# EAGLE design Light Cube (EAGLE 6.4)
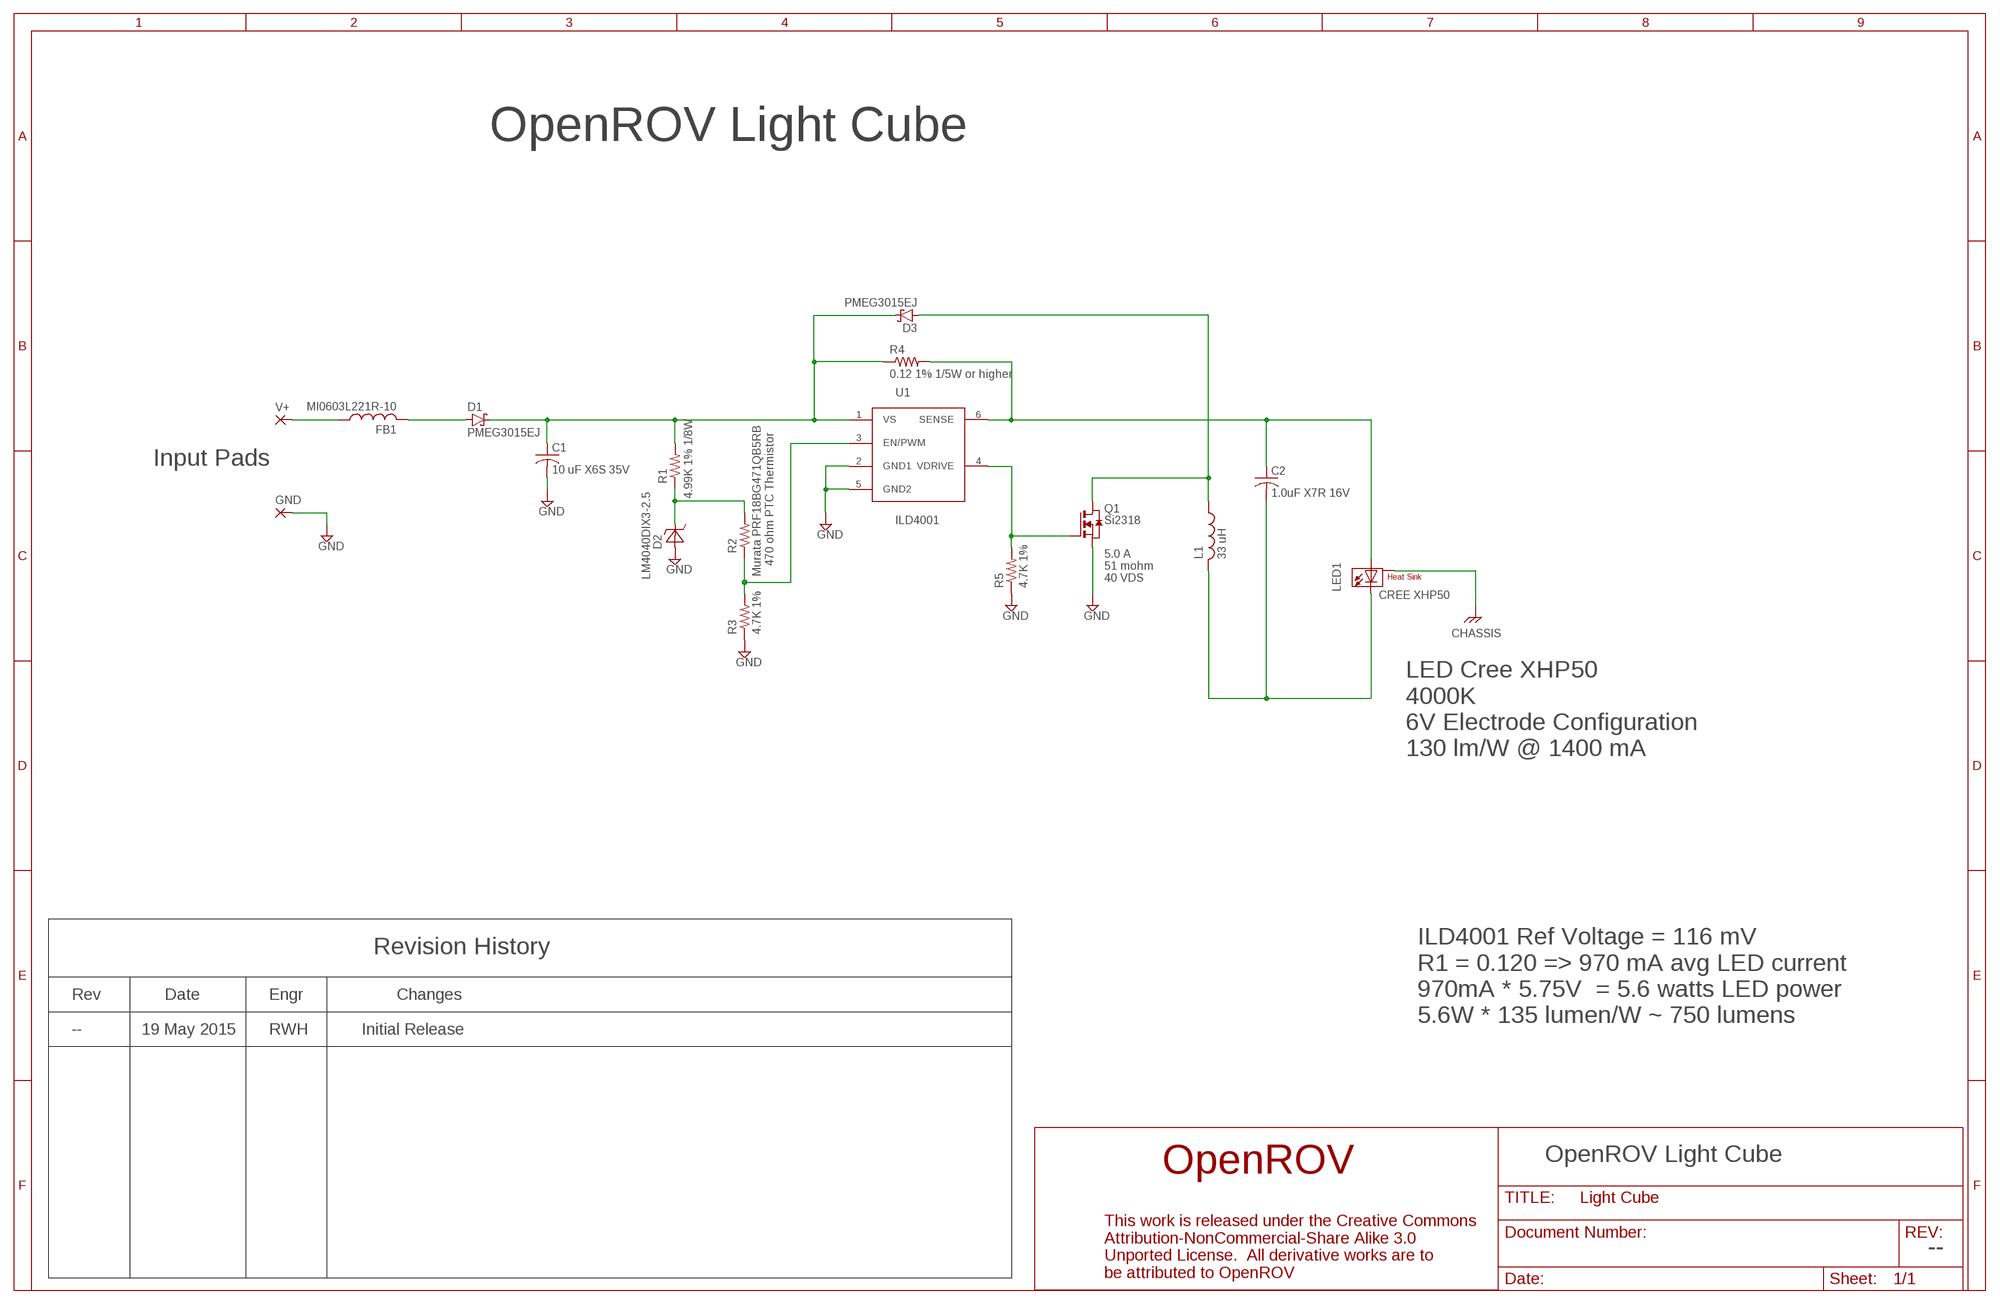
[diagram p0: schematic, sheet 1]

## Parts
C1  10 uF X6S 35V  CAP0805  [R0805]
C2  1.0uF X7R 16V  CAP0603  [R0603]
D1  PMEG3015EJ  SCHOTTKYSOD323  [SOD323]
D2  LM4040DIX3-2.5  ZENER-TVS-SC70-3  [SC70-3]
D3  PMEG3015EJ  SCHOTTKYSOD323  [SOD323]
FB1  MI0603L221R-10  FERRITESIZE_0603  [R0603]
GND  SMD_PAD3/3  [SMD_3_3]
L1  33 uH  INDUCTOR-LAIRD_TYS6045  [INDUCTOR_LAIRD_TYS6045]
LED1  CREE XHP50  LED_WITH_HEATSINK-CREE_XHP50_6V  [CREE_XHP50_6V]
Q1  Si2318  NMOS-FETSOT23  [SOT23]
R1  4.99K 1% 1/8W  RESISTOR-0402  [R0402]
R2  Murata PRF18BG471QB5RB  RESISTOR-0603  [R0603]
R3  4.7K 1%  RESISTOR-0402  [R0402]
R4  0.12 1% 1/5W or higher  RESISTOR-0603  [R0603]
R5  4.7K 1%  RESISTOR-0402  [R0402]
U1  ILD4001  [SC74_INFINEON]
V+  SMD_PAD-2/2  [SMD_2_2]

## Nets
CHASSIS: LED1.SINK(HEATSINK)
GND: C1.2 D2.2(A) GND.1(P) Q1.2(S) R3.1 R5.1 U1.2(GND1) U1.5(GND2)
N$1: D2.1(C) R1.1 R2.2
N$2: FB1.1 V+.1(P)
N$3: D1.A FB1.2
N$5: C1.1 D1.C D3.C R1.2 R4.1 U1.1(VS)
N$6: R2.1 R3.2 U1.3(EN/PWM)
N$7: C2.1 LED1.A R4.2 U1.6(SENSE)
N$8: D3.A L1.P$1 Q1.3(D)
N$9: C2.2 L1.P$2 LED1.C
N$11: Q1.1(G) R5.2 U1.4(VDRIVE)

## Notes on the sheet
- OpenROV Light Cube
- Input Pads
- 470 ohm PTC Thermistor
- 5.0 A
  51 mohm
  40 VDS
- LED Cree XHP50
  4000K
  6V Electrode Configuration
  130 lm/W @ 1400 mA
- Revision History
- Rev | Date | Engr | Changes
- ILD4001 Ref Voltage = 116 mV
  R1 = 0.120 => 970 mA avg LED current
  970mA * 5.75V  = 5.6 watts LED power
  5.6W * 135 lumen/W ~ 750 lumens
- -- | 19 May 2015 | RWH | Initial Release
- OpenROV Light Cube
- --

## Library data of the parts
C1 C2 = Walts_Generic_Parts:CAP: Generic Non-Polarized Capacitor
D1 D3 = Walts_Generic_Parts:SCHOTTKY: Silicon Schottky Diodes
D2 = Walts_Generic_Parts:ZENER-TVS: Generic Zener Diode, TVS, or Reference Diode
FB1 = Walts_Generic_Parts:FERRITE: Generic Surface Mount Ferrite Chip
GND V+ = Walts Test Points and Pads:SMD_PAD: SMD PAD
L1 = Walts_Generic_Parts:INDUCTOR: Generic Inductor Footprint
LED1 = OpenROV LED Library:LED_WITH_HEATSINK: Power LED packages with a heatsink pad
Q1 = Walts_Generic_Parts:NMOS-FET: Generic NMOS FET
R1-R5 = Walts_Generic_Parts:RESISTOR: Generic Resistor
U1 = OpenROV LED Library:ILD4001: Infineon ILD4001 Buck LED Controller

## Board
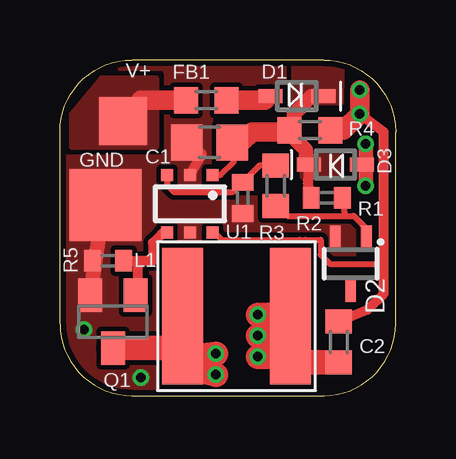
[diagram p1: board, top side]
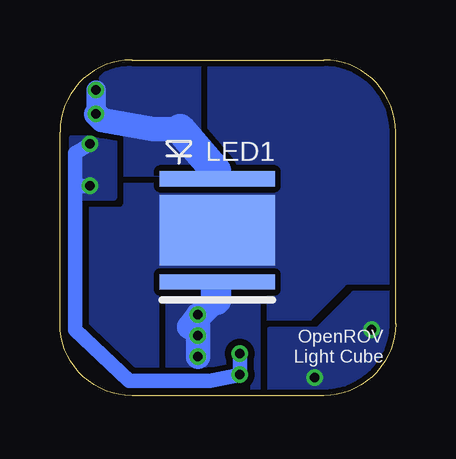
[diagram p2: board, bottom side, seen from below]

Size 14 x 14 mm. Coordinates in mm from the lower left corner, seen from the top.
Outline: 3,0 11,0 arc90 14,3 14,11 arc90 11,14 3,14 arc90 0,11 0,3 arc90 3,0
Copper layers (1*2*15*16): Top 0.035mm / dielectric 0.2mm / Route2 0.0175mm / dielectric 1.1mm / Route15 0.0175mm / dielectric 0.2mm / Bottom 0.035mm
Design rules "SeeedStudio_DRU_no_angle_20130527": minimum track width 6mil, minimum drill 12mil, track to track 6mil, track to pad 6mil, pad to pad 6mil, via to via 6mil, smd to smd 0mil, copper to edge 10mil, drill to drill 10mil, minimum pad ring 6mil, minimum via ring 6mil, stop-mask expansion 2mil, vias tented up to drill 25mil, thermal gap 10mil

### Footprints (pad centres in the part's own frame; a part is rotated, then mirrored left to right if it is on the bottom)
R0805 = smd 1.3 x 1.5: 1 -0.95,0; 2 0.95,0
R0603 = smd 1 x 1.1: 1 -0.85,0; 2 0.85,0
SOD323 = smd 1 x 0.6: A 1.1,0; C -1.1,0
SC70-3 = smd 0.45 x 1.1: 1 -0.65,-1.05; 2 0.65,-1.05; 3 0,1.05
SMD_3_3 = smd 3 x 3: 1 0,0
INDUCTOR_LAIRD_TYS6045 = smd 1.7 x 5.7: P$1 -2.25,0; P$2 2.25,0
CREE_XHP50_6V = smd 0.64 x 4.8: A -2.15,0; C 2.15,0 | smd 2.94 x 4.8: SINK 0,0
SOT23 = smd 1 x 1.4: 1 -0.95,-1.1; 2 0.95,-1.1; 3 0,1.1
R0402 = smd 0.7 x 0.9: 1 -0.65,0; 2 0.65,0
SC74_INFINEON = smd 0.5 x 0.5: 1 -0.95,-1.2; 2 0,-1.2; 3 0.95,-1.2; 4 0.95,1.2; 5 0,1.2; 6 -0.95,1.2
SMD_2_2 = smd 2 x 2: 1 0,0

### Placement (x,y rotation side)
C1  6.24,10.55 180 top
C2  11.63,2.24 270 top
D1  9.88,12.49 180 top
D2  12.12,5.5 180 top
D3  11.49,9.63 0 top
FB1  6.1,12.32 0 top
GND  1.91,7.95 0 top
L1  7.37,3.31 0 top
LED1  7.44,6.89 270 bottom
Q1  2.21,3.08 180 top
R1  11.12,8.25 180 top
R2  9,8.75 270 top
R3  7.62,8.25 90 top
R4  10.43,11.07 0 top
R5  2,5.62 0 top
U1  5.42,8 180 top
V+  2.63,11.45 0 top

### Tracks (layer width: path | path; a pad name or v marks a point on that pad's centre or on a via)
CHASSIS
  pour Bottom (isolate 0.254, rank 6, no thermals): 0,0 0,14 14,14 14,0
GND  (via drill 0.4)
  Top 0.406: U1.2 5.92,10.08 C1.2
  Top 0.61: Q1.2 1.76,7.55
  other vias: 1,2.75 3.38,0.75
  pour Top (isolate 0.2, rank 6, no thermals): 0,0 0,14 14,14 14,0
  pour Bottom (isolate 0.254, rank 2): 0,4.25 1.75,4.25 3.25,2.75 5.25,2.75 5.25,0 0,0
N$1
  Top 0.254: R2.2 9.1,8 9.5,7.5 11.88,7.5 | 11.88,7.5 12.25,7.5 12.75,7 12.75,6.58 D2.1 | R1.1 11.78,8.1 11.88,7.5
N$2
  Top 0.61: 3.38,12.32 V+.1
  Top 0.813: FB1.1 3.38,12.32
  pour Top (isolate 0.254, no thermals): 4,10.38 0.5,10.38 0.5,11.75 1.75,13.25 4,13.25
N$3
  Top 0.61: 8.56,12.32 D1.A
  Top 0.813: FB1.2 8.56,12.32
N$5
  Top 0.254: D1.C | R4.1 9.68,11.07 9.68,10.82 | 10.25,9.78 D3.C 10.38,9.62 | U1.1 6.7,9.2 7.25,9.75 7.25,10.49 C1.1
  Top 0.406: R1.2 10.35,8.9 10.38,9.12 10.38,9.62
  Top 0.61: 9.68,10.82 10.25,10.25 10.25,9.78 | D1.C 10.49,12.49 9.75,11.75 9.75,11.24 R4.1
  Top 0.813: C1.1 7.55,10.55 8,11 9.51,11 R4.1
  pour Top (isolate 0.254, no thermals): 9.75,13.75 9.75,12.25 11.75,12.25 11.75,13.75
  pour Top (no thermals): 10.25,10 11.62,10 11.62,9.12 10.12,9.12 10.12,10
N$6
  Top 0.254: R2.1 8.32,9.6 R3.2 7.22,8.5 4.75,8.5 4.47,8.78 U1.3
N$7  (via drill 0.4)
  Top 0.254: U1.6 6.5,6.75 6.75,6.5 10.01,6.5 10.26,6.5 10.87,6.5 10.88,6.5 10.88,5.88 11.25,5.5 13.5,5.5
  Top 0.406: C2.1 12.84,3.59 13.5,4.25 13.5,5.5 13.5,11 v12.5,11.75
  Top 0.813: v12.5,12.75 v12.5,11.75 11.82,11.07 R4.2
  Bottom 0.254: LED1.A 7.44,9.19 7.5,9.38
  Bottom 0.813: v12.5,12.75 v12.5,11.75
  Bottom 1.016: v12.5,11.75 12.25,11.5 10.12,11.12 9,11.12
  Bottom 1.27: 7.5,9.38 9,11.12
  pour Bottom (isolate 0.254, rank 3): 8.25,13.75 8.25,9.25 12,9.25 12,12 12.25,12.25 12.25,13.25 11.75,13.75
N$8  (via drill 0.4)
  Top 0.61: v12.75,10.5 12.75,9.79 D3.A 12.75,9.47 v12.75,8.75
  Top 1.016: Q1.3 5,1.99 | 5,1.99 5.07,1.99 | 5.99,1 v6.5,0.88 5.99,1 | 5.07,1.99 5.07,3.26 L1.P$1 | v6.5,1.75 5.42,1.62 5.07,1.99 | 5.99,1 5,1.99
  Bottom 0.61: 13.38,8.75 13.38,10.12 v12.75,10.5 | 13.38,8.75 13.38,2.75 11.12,0.62 7.75,0.62 v6.5,0.88 v6.5,1.75 | v12.75,8.75 13.38,8.75
  pour Bottom (isolate 0.254): 11.75,10.75 11.75,8.25 13.5,8.25 13.5,10.75
N$9  (via drill 0.4)
  Top 1.016: v8.25,1.62 9.62,1.62 9.86,1.39 C2.2 | v8.25,2.5 9.25,2.5 9.5,2.75 9.5,3.19 L1.P$2 | v8.25,3.38 9.38,3.38 9.5,3.5 9.75,3.5
  Bottom 0.254: 7.5,4.38 7.5,4.8 LED1.C
  Bottom 1.016: v8.25,1.62 v8.25,2.5 v8.25,3.38 8.62,2.88 7.5,4
  Bottom 1.27: 7.5,4 7.5,4.38
  pour Bottom (isolate 0.254): 5.75,0 5.75,4 9.5,4 9.5,0
N$11
  Top 0.406: Q1.1 3.25,4.28 3.25,5.62 | U1.4 4.42,6.75 4.25,6.75 3.88,6.38 3.88,5.62 3.25,5.62 | R5.2 3.25,5.62

### Text on the board
bPlace: OpenROV / Light Cube